# Altium project BK Robot.PrjPcb
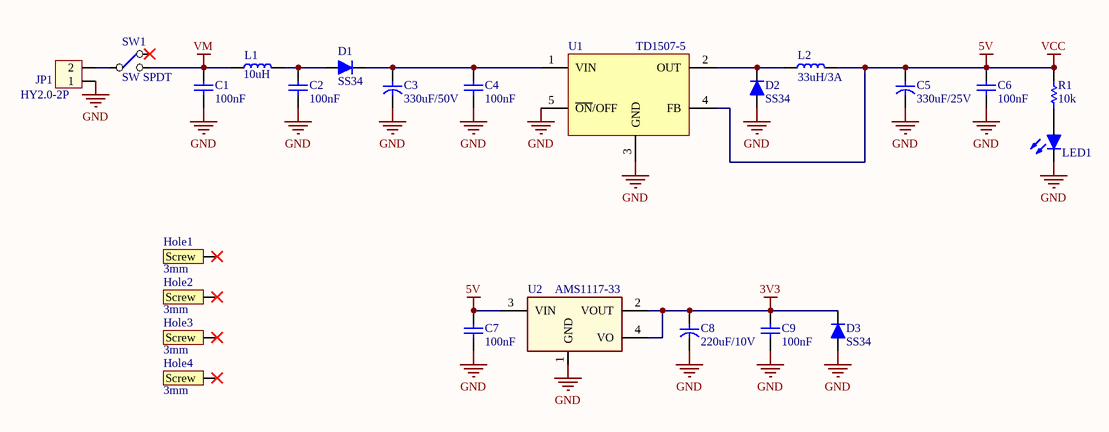
[diagram p0: Power.SchDoc]
5 sheets, 189 parts. Net scope: flat (ports and power ports of the same name join across sheets).
Board file: BK Robot.PcbDoc
Sheets:
  Power.SchDoc
  MCU.SchDoc
  MotorDriver.SchDoc
  Debug.SchDoc
  Peripheral.SchDoc

## Sheet Power.SchDoc
size A; SheetNumber: 1; SheetTotal: 5

### Parts
C1  100nF  [C 0603 (1608)]
C2  100nF  [C 0603 (1608)]
C3  330uF/50V  [C SMD ALU (G)]
C4  100nF  [C 0603 (1608)]
C5  330uF/25V  [C SMD ALU (F)]
C6  100nF  [C 0603 (1608)]
C7  100nF  [C 0603 (1608)]
C8  220uF/10V  [C SMD ALU (D)]
C9  100nF  [C 0603 (1608)]
D1  SS34  [DO-214AC (SMA)]
D2  SS34  [DO-214AC (SMA)]
D3  SS34  [DO-214AC (SMA)]
Hole1  3mm  [SCREW/3M/7M]
Hole2  3mm  [SCREW/3M/7M]
Hole3  3mm  [SCREW/3M/7M]
Hole4  3mm  [SCREW/3M/7M]
JP1  HY2.0-2P  [HY2.0-2P-RA]
L1  10uH  [Inductor SMD 0420]
L2  33uH/3A  [Inductor SMD 10x10x5]
LED1  Led-Red  [Led SMD 0603]  (value not drawn)
R1  10k  [R 0603 (1608)]
SW1  SW SPDT  [SW/3/SPDT/SS12D11]
U1  TD1507-5  [TO-252-5]
U2  AMS1117-33  [SOT-223]

### Nets
3V3: C8.1 C9.1 D3.2(K) U2.2(VOUT) U2.4(VO)
5V: C5.1 C6.1 C7.1 L2.2 R1.2 U1.4(FB) U2.3(VIN)  [also labelled VCC]
GND: C1.2 C2.2 C3.2 C4.2 C5.2 C6.2 C7.2 C8.2 C9.2 D2.1(A) D3.1(A) JP1.1 LED1.2(K) U1.3(GND) U1.5(~{ON}/OFF) U1.6(GND) U2.1(GND)
VM: C1.1 L1.1 SW1.3(NO1)
NetC2_1: C2.1 D1.1(A) L1.2
NetC3_1: C3.1 C4.1 D1.2(K) U1.1(VIN)
NetD2_2: D2.2(K) L2.1 U1.2(OUT)
NetJP1_2: JP1.2 SW1.2(COMMON1)
NetLED1_1: LED1.1(A) R1.1

Not connected (* = marked no-connect by the designer): Hole1 1(Screw)*; Hole2 1(Screw)*; Hole3 1(Screw)*; Hole4 1(Screw)*; SW1 1(NC1)*

### Library data of the parts
C1 C2 C4 C6 C7 C9 = Capacitor NP: Capacitor non-pol
C3 C5 C8 = Capacitor: Capacitor pol
D1-D3 = Diode: Default Diode; Published: 8-Jun-2000; LatestRevisionDate: 17-Jul-2002; LatestRevisionNote: Re-released for DXP Platform.; PackageVersion: Sep-1996; PackageReference: SMC; Publisher: Altium Limited; Code_JEDEC: DO-214-AB
Hole1-Hole4 = Screw
JP1 = Con2: Connector 2; Value: Connector 2
L1 L2 = Inductor
LED1 = Led: Typical LED
R1 = Resistor: Published: 8-Jun-2000; LatestRevisionDate: 17-Jul-2002; LatestRevisionNote: Re-released for DXP Platform.; PackageReference: AXIAL-0.3; Publisher: Altium Limited
U1 = TD1507: 4A 300KHz 32V Buck DC to DC Converter
U2 = AMS1117: 1A LDO Voltage Regulator, ADJ or fixed 1.5/1.8/2.5/2.85/3.3/5V

## Sheet MCU.SchDoc
size A3; SheetNumber: 2; SheetTotal: 5
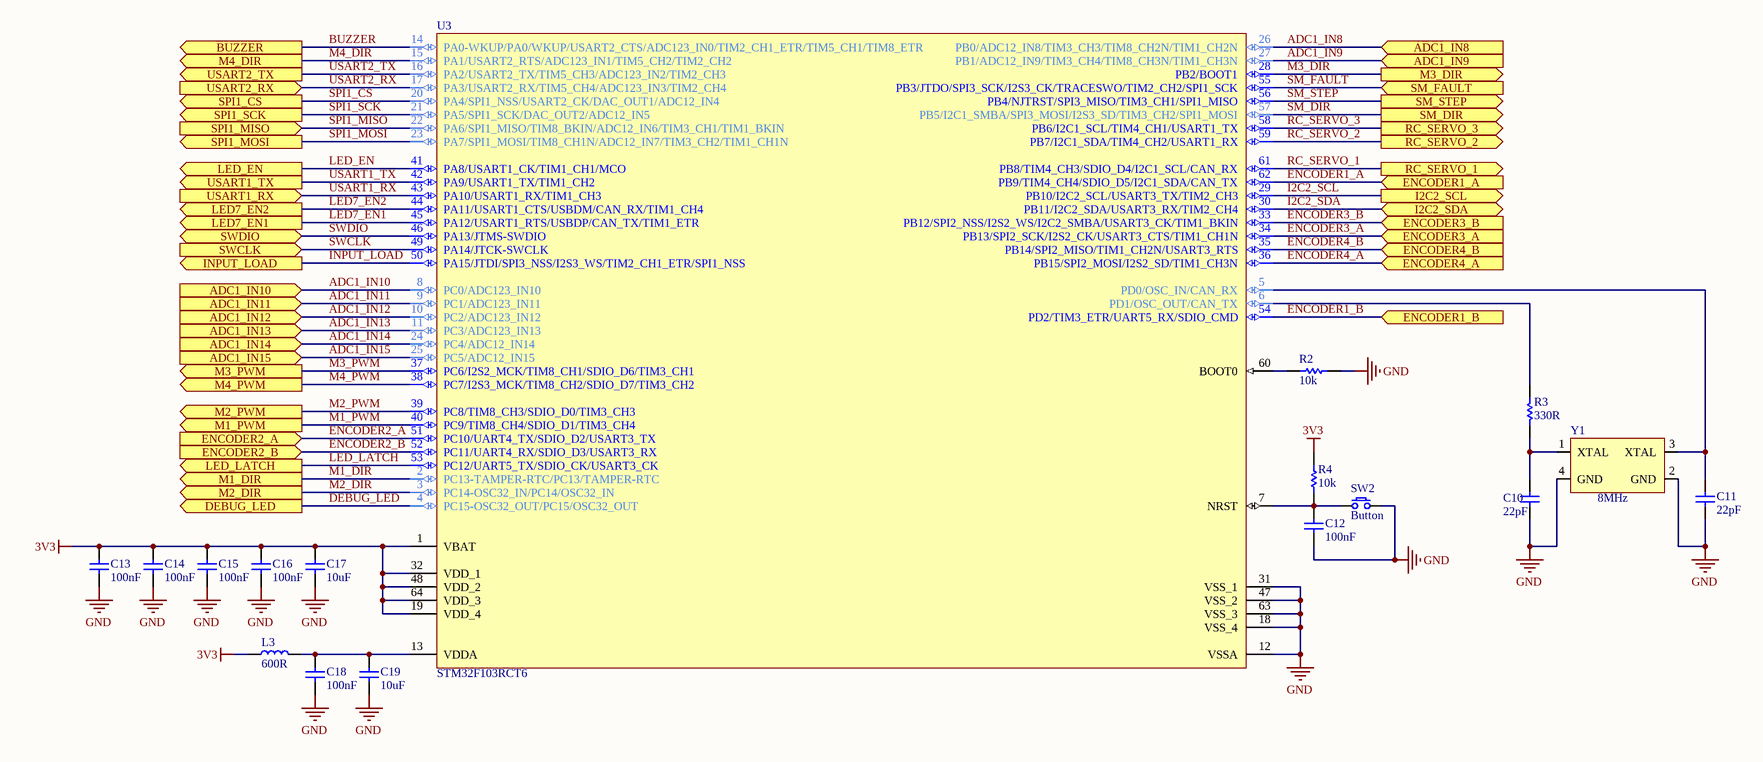
[diagram p1: MCU.SchDoc]

### Parts
C10  22pF  [C 0603 (1608)]
C11  22pF  [C 0603 (1608)]
C12  100nF  [C 0603 (1608)]
C13  100nF  [C 0603 (1608)]
C14  100nF  [C 0603 (1608)]
C15  100nF  [C 0603 (1608)]
C16  100nF  [C 0603 (1608)]
C17  10uF  [C 0603 (1608)]
C18  100nF  [C 0603 (1608)]
C19  10uF  [C 0603 (1608)]
L3  600R  [L 0603 (1608)]
R2  10k  [R 0603 (1608)]
R3  330R  [R 0603 (1608)]
R4  10k  [R 0603 (1608)]
SW2  Button  [SW/2/SMD - 6X6X5]
U3  STM32F103RCT6  [LQFP64_N]
Y1  8MHz  [Crystal SMD 4PIN 3225]

### Ports
ADC1_IN8 (in), ADC1_IN9 (in), ADC1_IN10 (in), ADC1_IN11 (in), ADC1_IN12 (in), ADC1_IN13 (in), ADC1_IN14 (in), ADC1_IN15 (in), BUZZER (out), DEBUG_LED (out), ENCODER1_A (in), ENCODER1_B (in), ENCODER2_A (in), ENCODER2_B (in), ENCODER3_A (in), ENCODER3_B (in), ENCODER4_A (in), ENCODER4_B (in), I2C2_SCL (out), I2C2_SDA (bidir), INPUT_LOAD (out), LED7_EN1 (out), LED7_EN2 (out), LED_EN (out), LED_LATCH (out), M1_DIR (out), M1_PWM (out), M2_DIR (out), M2_PWM (out), M3_DIR (out), M3_PWM (out), M4_DIR (out), M4_PWM (out), RC_SERVO_1 (out), RC_SERVO_2 (out), RC_SERVO_3 (out), SM_DIR (out), SM_FAULT (in), SM_STEP (out), SPI1_CS (out), SPI1_MISO (in), SPI1_MOSI (out), SPI1_SCK (out), SWCLK (in), SWDIO (bidir), USART1_RX (in), USART1_TX (out), USART2_RX (in), USART2_TX (out)

### Nets
3V3: C13.1 C14.1 C15.1 C16.1 C17.1 L3.2 R4.1 U3.1(VBAT) U3.19(VDD_4) U3.32(VDD_1) U3.48(VDD_2) U3.64(VDD_3)
GND: C10.2 C11.2 C12.2 C13.2 C14.2 C15.2 C16.2 C17.2 C18.2 C19.2 R2.1 SW2.2 U3.12(VSSA) U3.18(VSS_4) U3.31(VSS_1) U3.47(VSS_2) U3.63(VSS_3) Y1.2(GND) Y1.4(GND)
ADC1_IN8: U3.26(PB0/ADC12_IN8/TIM3_CH3/TIM8_CH2N/TIM1_CH2N) ; port ADC1_IN8
ADC1_IN9: U3.27(PB1/ADC12_IN9/TIM3_CH4/TIM8_CH3N/TIM1_CH3N) ; port ADC1_IN9
ADC1_IN10: U3.8(PC0/ADC123_IN10) ; port ADC1_IN10
ADC1_IN11: U3.9(PC1/ADC123_IN11) ; port ADC1_IN11
ADC1_IN12: U3.10(PC2/ADC123_IN12) ; port ADC1_IN12
ADC1_IN13: U3.11(PC3/ADC123_IN13) ; port ADC1_IN13
ADC1_IN14: U3.24(PC4/ADC12_IN14) ; port ADC1_IN14
ADC1_IN15: U3.25(PC5/ADC12_IN15) ; port ADC1_IN15
BUZZER: U3.14(PA0-WKUP/PA0/WKUP/USART2_CTS/ADC123_IN0/TIM2_CH1_ETR/TIM5_CH1/TIM8_ETR) ; port BUZZER
DEBUG_LED: U3.4(PC15-OSC32_OUT/PC15/OSC32_OUT) ; port DEBUG_LED
ENCODER1_A: U3.62(PB9/TIM4_CH4/SDIO_D5/I2C1_SDA/CAN_TX) ; port ENCODER1_A
ENCODER1_B: U3.54(PD2/TIM3_ETR/UART5_RX/SDIO_CMD) ; port ENCODER1_B
ENCODER2_A: U3.51(PC10/UART4_TX/SDIO_D2/USART3_TX) ; port ENCODER2_A
ENCODER2_B: U3.52(PC11/UART4_RX/SDIO_D3/USART3_RX) ; port ENCODER2_B
ENCODER3_A: U3.34(PB13/SPI2_SCK/I2S2_CK/USART3_CTS/TIM1_CH1N) ; port ENCODER3_A
ENCODER3_B: U3.33(PB12/SPI2_NSS/I2S2_WS/I2C2_SMBA/USART3_CK/TIM1_BKIN) ; port ENCODER3_B
ENCODER4_A: U3.36(PB15/SPI2_MOSI/I2S2_SD/TIM1_CH3N) ; port ENCODER4_A
ENCODER4_B: U3.35(PB14/SPI2_MISO/TIM1_CH2N/USART3_RTS) ; port ENCODER4_B
I2C2_SCL: U3.29(PB10/I2C2_SCL/USART3_TX/TIM2_CH3) ; port I2C2_SCL
I2C2_SDA: U3.30(PB11/I2C2_SDA/USART3_RX/TIM2_CH4) ; port I2C2_SDA
INPUT_LOAD: U3.50(PA15/JTDI/SPI3_NSS/I2S3_WS/TIM2_CH1_ETR/SPI1_NSS) ; port INPUT_LOAD
LED7_EN1: U3.45(PA12/USART1_RTS/USBDP/CAN_TX/TIM1_ETR) ; port LED7_EN1
LED7_EN2: U3.44(PA11/USART1_CTS/USBDM/CAN_RX/TIM1_CH4) ; port LED7_EN2
LED_EN: U3.41(PA8/USART1_CK/TIM1_CH1/MCO) ; port LED_EN
LED_LATCH: U3.53(PC12/UART5_TX/SDIO_CK/USART3_CK) ; port LED_LATCH
M1_DIR: U3.2(PC13-TAMPER-RTC/PC13/TAMPER-RTC) ; port M1_DIR
M1_PWM: U3.40(PC9/TIM8_CH4/SDIO_D1/TIM3_CH4) ; port M1_PWM
M2_DIR: U3.3(PC14-OSC32_IN/PC14/OSC32_IN) ; port M2_DIR
M2_PWM: U3.39(PC8/TIM8_CH3/SDIO_D0/TIM3_CH3) ; port M2_PWM
M3_DIR: U3.28(PB2/BOOT1) ; port M3_DIR
M3_PWM: U3.37(PC6/I2S2_MCK/TIM8_CH1/SDIO_D6/TIM3_CH1) ; port M3_PWM
M4_DIR: U3.15(PA1/USART2_RTS/ADC123_IN1/TIM5_CH2/TIM2_CH2) ; port M4_DIR
M4_PWM: U3.38(PC7/I2S3_MCK/TIM8_CH2/SDIO_D7/TIM3_CH2) ; port M4_PWM
RC_SERVO_1: U3.61(PB8/TIM4_CH3/SDIO_D4/I2C1_SCL/CAN_RX) ; port RC_SERVO_1
RC_SERVO_2: U3.59(PB7/I2C1_SDA/TIM4_CH2/USART1_RX) ; port RC_SERVO_2
RC_SERVO_3: U3.58(PB6/I2C1_SCL/TIM4_CH1/USART1_TX) ; port RC_SERVO_3
SM_DIR: U3.57(PB5/I2C1_SMBA/SPI3_MOSI/I2S3_SD/TIM3_CH2/SPI1_MOSI) ; port SM_DIR
SM_FAULT: U3.55(PB3/JTDO/SPI3_SCK/I2S3_CK/TRACESWO/TIM2_CH2/SPI1_SCK) ; port SM_FAULT
SM_STEP: U3.56(PB4/NJTRST/SPI3_MISO/TIM3_CH1/SPI1_MISO) ; port SM_STEP
SPI1_CS: U3.20(PA4/SPI1_NSS/USART2_CK/DAC_OUT1/ADC12_IN4) ; port SPI1_CS
SPI1_MISO: U3.22(PA6/SPI1_MISO/TIM8_BKIN/ADC12_IN6/TIM3_CH1/TIM1_BKIN) ; port SPI1_MISO
SPI1_MOSI: U3.23(PA7/SPI1_MOSI/TIM8_CH1N/ADC12_IN7/TIM3_CH2/TIM1_CH1N) ; port SPI1_MOSI
SPI1_SCK: U3.21(PA5/SPI1_SCK/DAC_OUT2/ADC12_IN5) ; port SPI1_SCK
SWCLK: U3.49(PA14/JTCK-SWCLK) ; port SWCLK
SWDIO: U3.46(PA13/JTMS-SWDIO) ; port SWDIO
USART1_RX: U3.43(PA10/USART1_RX/TIM1_CH3) ; port USART1_RX
USART1_TX: U3.42(PA9/USART1_TX/TIM1_CH2) ; port USART1_TX
USART2_RX: U3.17(PA3/USART2_RX/TIM5_CH4/ADC123_IN3/TIM2_CH4) ; port USART2_RX
USART2_TX: U3.16(PA2/USART2_TX/TIM5_CH3/ADC123_IN2/TIM2_CH3) ; port USART2_TX
NetC10_1: C10.1 R3.1 Y1.1(XTAL)
NetC11_1: C11.1 U3.5(PD0/OSC_IN/CAN_RX) Y1.3(XTAL)
NetC12_1: C12.1 R4.2 SW2.1 U3.7(NRST)
NetC18_1: C18.1 C19.1 L3.1 U3.13(VDDA)
NetR2_2: R2.2 U3.60(BOOT0)
NetR3_2: R3.2 U3.6(PD1/OSC_OUT/CAN_TX)

### Library data of the parts
C10-C19 = Capacitor NP: Capacitor non-pol
L3 = Inductor
R2-R4 = Resistor: Published: 8-Jun-2000; LatestRevisionDate: 17-Jul-2002; LatestRevisionNote: Re-released for DXP Platform.; PackageReference: AXIAL-0.3; Publisher: Altium Limited
SW2 = SW SPST: Tact switch 2 pin
U3 = STM32F103RCT6: ARM Cortex-M3 32-bit MCU, 256 KB Flash, 48 KB Internal RAM, 51 I/Os, 64-pin LQFP, -40 to 85 degC, Tray; A/D Converter: 3x12-bit (16 Channel); D/A Converter: 2x12-bit (2 Channel); FLASH Size (Prog) (kB): 256; I/Os (High Current): 51; Internal RAM Size (kB): 48; Operating Frequency(F) (Processor speed) (MHz): 72; Supply Voltage(Vcc) min (V): 2; DatasheetVersion: Rev. 8; PackageVersion: Rev. 4, 06/2013; PackageReference: LQFP64; PackageDescription: 64-Pin Low Profile Quad Flat Package, 10 x 10 mm Body, 0.5 mm Pitch; Supplier 1: Digi-Key; Supplier Part Number 1: 497-9033-ND; Supplier 2: Newark; Supplier Part Number 2: 01P4099; Supplier 3: Newark; Supplier Part Number 3: 57P1227; Supplier 4: Mouser; Supplier Part Number 4: 511-STM32F103RCT6; Core: ARM Cortex-M3; Packing: Tray; Mounting Technology: Surface Mount; PartNumber: STM32F103RCT6; ComponentLink1Description: Manufacturer URL; ComponentLink1URL: http://www.st.com/web/en/home.html; ComponentLink2Description: Datasheet; ComponentLink2URL: http://www.st.com/st-web-ui/static/active/en/resource/technical/document/datasheet/CD00191185.pdf; ComponentLink3Description: Package Specification; ComponentLink3URL: http://www.st.com/st-web-ui/static/active/en/resource/technical/document/datasheet/DM00037051.pdf
Y1 = Crystal 4pin

## Sheet MotorDriver.SchDoc
size A3; SheetNumber: 3; SheetTotal: 4
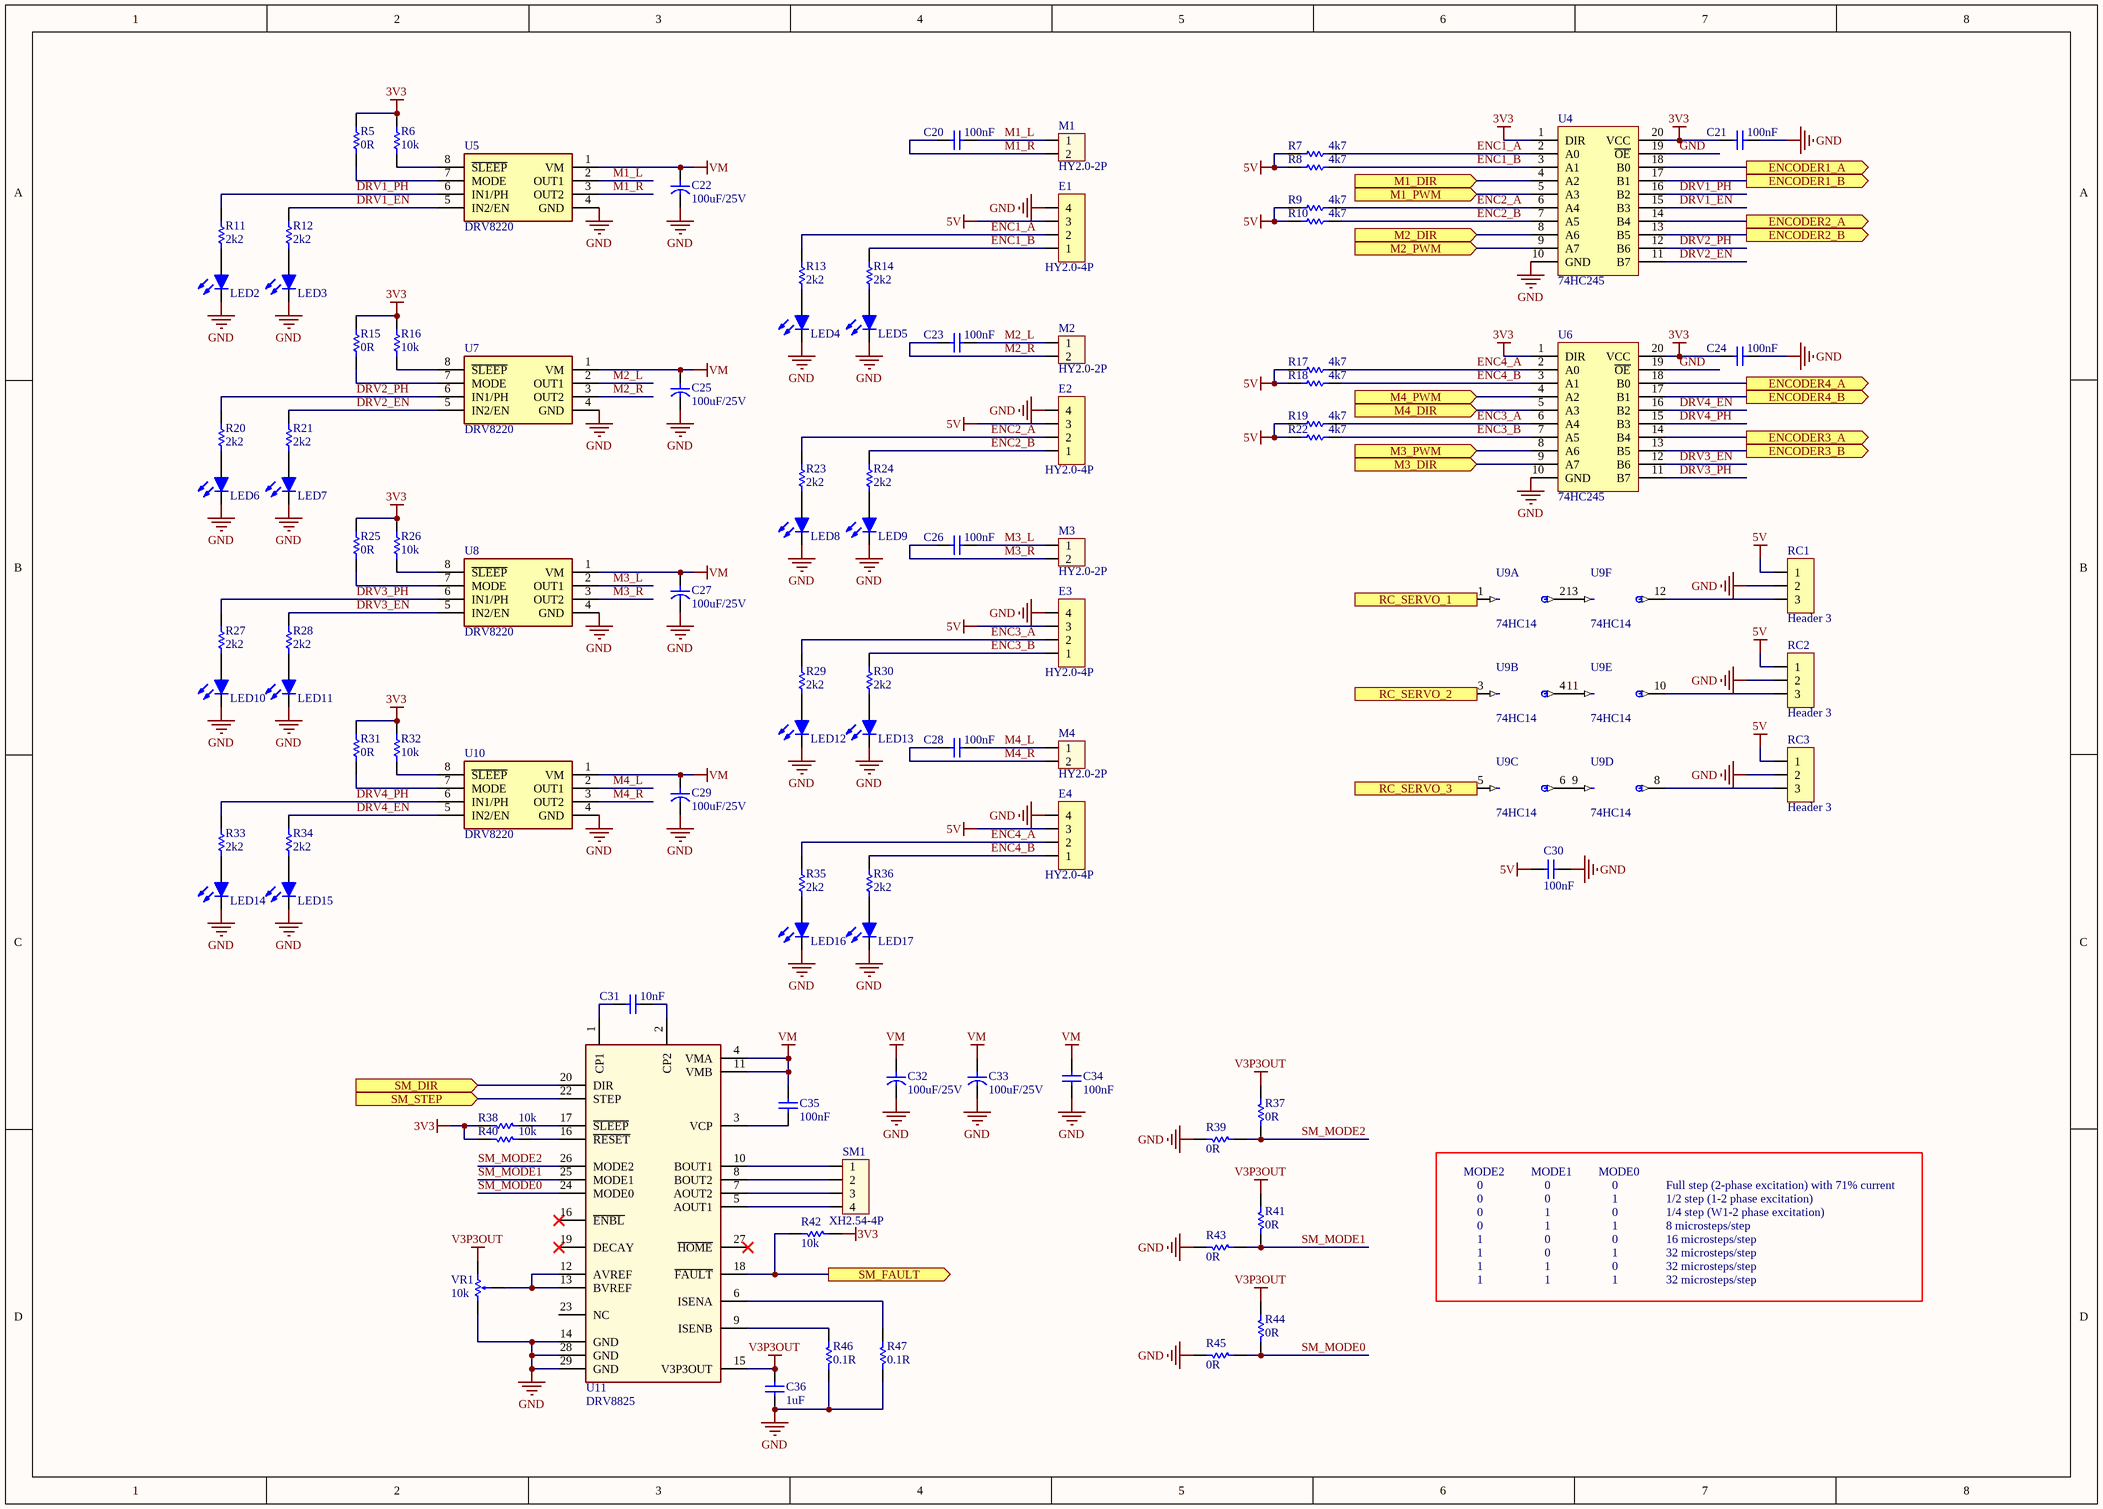
[diagram p2: MotorDriver.SchDoc]

### Parts
C20  100nF  [C 0603 (1608)]
C21  100nF  [C 0603 (1608)]
C22  100uF/25V  [C SMD ALU (D8)]
C23  100nF  [C 0603 (1608)]
C24  100nF  [C 0603 (1608)]
C25  100uF/25V  [C SMD ALU (D8)]
C26  100nF  [C 0603 (1608)]
C27  100uF/25V  [C SMD ALU (D8)]
C28  100nF  [C 0603 (1608)]
C29  100uF/25V  [C SMD ALU (D8)]
C30  100nF  [C 0603 (1608)]
C31  10nF  [C 0603 (1608)]
C32  100uF/25V  [C SMD ALU (D8)]
C33  100uF/25V  [C SMD ALU (D8)]
C34  100nF  [C 0603 (1608)]
C35  100nF  [C 0603 (1608)]
C36  1uF  [C 0603 (1608)]
E1  HY2.0-4P  [HY2.0-4P-RA]
E2  HY2.0-4P  [HY2.0-4P-RA]
E3  HY2.0-4P  [HY2.0-4P-RA]
E4  HY2.0-4P  [HY2.0-4P-RA]
LED2  Led-Red  [Led SMD 0603]  (value not drawn)
LED3  Led-Red  [Led SMD 0603]  (value not drawn)
LED4  Led-Red  [Led SMD 0603]  (value not drawn)
LED5  Led-Red  [Led SMD 0603]  (value not drawn)
LED6  Led-Red  [Led SMD 0603]  (value not drawn)
LED7  Led-Red  [Led SMD 0603]  (value not drawn)
LED8  Led-Red  [Led SMD 0603]  (value not drawn)
LED9  Led-Red  [Led SMD 0603]  (value not drawn)
LED10  Led-Red  [Led SMD 0603]  (value not drawn)
LED11  Led-Red  [Led SMD 0603]  (value not drawn)
LED12  Led-Red  [Led SMD 0603]  (value not drawn)
LED13  Led-Red  [Led SMD 0603]  (value not drawn)
LED14  Led-Red  [Led SMD 0603]  (value not drawn)
LED15  Led-Red  [Led SMD 0603]  (value not drawn)
LED16  Led-Red  [Led SMD 0603]  (value not drawn)
LED17  Led-Red  [Led SMD 0603]  (value not drawn)
M1  HY2.0-2P  [HY2.0-2P-RA]
M2  HY2.0-2P  [HY2.0-2P-RA]
M3  HY2.0-2P  [HY2.0-2P-RA]
M4  HY2.0-2P  [HY2.0-2P-RA]
R5  0R  [R 0603 (1608)]
R6  10k  [R 0603 (1608)]
R7  4k7  [R 0603 (1608)]
R8  4k7  [R 0603 (1608)]
R9  4k7  [R 0603 (1608)]
R10  4k7  [R 0603 (1608)]
R11  2k2  [R 0603 (1608)]
R12  2k2  [R 0603 (1608)]
R13  2k2  [R 0603 (1608)]
R14  2k2  [R 0603 (1608)]
R15  0R  [R 0603 (1608)]
R16  10k  [R 0603 (1608)]
R17  4k7  [R 0603 (1608)]
R18  4k7  [R 0603 (1608)]
R19  4k7  [R 0603 (1608)]
R20  2k2  [R 0603 (1608)]
R21  2k2  [R 0603 (1608)]
R22  4k7  [R 0603 (1608)]
R23  2k2  [R 0603 (1608)]
R24  2k2  [R 0603 (1608)]
R25  0R  [R 0603 (1608)]
R26  10k  [R 0603 (1608)]
R27  2k2  [R 0603 (1608)]
R28  2k2  [R 0603 (1608)]
R29  2k2  [R 0603 (1608)]
R30  2k2  [R 0603 (1608)]
R31  0R  [R 0603 (1608)]
R32  10k  [R 0603 (1608)]
R33  2k2  [R 0603 (1608)]
R34  2k2  [R 0603 (1608)]
R35  2k2  [R 0603 (1608)]
R36  2k2  [R 0603 (1608)]
R37  0R  [R 0603 (1608)]
R38  10k  [R 0603 (1608)]
R39  0R  [R 0603 (1608)]
R40  10k  [R 0603 (1608)]
R41  0R  [R 0603 (1608)]
R42  10k  [R 0603 (1608)]
R43  0R  [R 0603 (1608)]
R44  0R  [R 0603 (1608)]
R45  0R  [R 0603 (1608)]
R46  0.1R  [R 1206 (3216)]
R47  0.1R  [R 1206 (3216)]
RC1  Header 3  [Header 3 - RA]
RC2  Header 3  [Header 3 - RA]
RC3  Header 3  [Header 3 - RA]
SM1  XH2.54-4P  [CON Header 4 - RA]
U4  74HC245  [TSSOP 20 65P]
U5  DRV8220  [WSON 2X2X0.5MM]
U6  74HC245  [TSSOP 20 65P]
U7  DRV8220  [WSON 2X2X0.5MM]
U8  DRV8220  [WSON 2X2X0.5MM]
U9  74HC14  [TSSOP 14 65P]  (parts A,B,C,D,E,F of 6)
U10  DRV8220  [WSON 2X2X0.5MM]
U11  DRV8825  [TSSOP 28 65P EP]
VR1  10k  [TRIM_TC33X-2-103E]

### Ports
ENCODER1_A (out), ENCODER1_B (out), ENCODER2_A (out), ENCODER2_B (out), ENCODER3_A (out), ENCODER3_B (out), ENCODER4_A (out), ENCODER4_B (out), M1_DIR (in), M1_PWM (in), M2_DIR (in), M2_PWM (in), M3_DIR (in), M3_PWM (in), M4_DIR (in), M4_PWM (in), RC_SERVO_1 (in), RC_SERVO_2 (in), RC_SERVO_3 (in), SM_DIR (in), SM_FAULT (out), SM_STEP (in)

### Nets
3V3: C21.1 C24.1 R5.2 R6.2 R15.2 R16.2 R25.2 R26.2 R31.2 R32.2 R38.1 R40.1 R42.2 U4.1(DIR) U4.20(VCC) U6.1(DIR) U6.20(VCC)
5V: C30.1 E1.3 E2.3 E3.3 E4.3 R7.2 R8.2 R9.2 R10.2 R17.2 R18.2 R19.2 R22.2 RC1.1 RC2.1 RC3.1 U9.14(+)  [also labelled VCC]
GND: C21.2 C22.2 C24.2 C25.2 C27.2 C29.2 C30.2 C32.2 C33.2 C34.1 C36.2 E1.4 E2.4 E3.4 E4.4 LED2.2(K) LED3.2(K) LED4.2(K) LED5.2(K) LED6.2(K) LED7.2(K) LED8.2(K) LED9.2(K) LED10.2(K) LED11.2(K) LED12.2(K) LED13.2(K) LED14.2(K) LED15.2(K) LED16.2(K) LED17.2(K) R39.1 R43.1 R45.1 R46.2 R47.2 RC1.2 RC2.2 RC3.2 U4.10(GND) U4.19(~{OE}) U5.4(GND) U6.10(GND) U6.19(~{OE}) U7.4(GND) U8.4(GND) U9.7(GND) U10.4(GND) U11.14(GND) U11.28(GND) U11.29(GND) VR1.3
V3P3OUT: C36.1 R37.1 R41.1 R44.1 U11.15(V3P3OUT) VR1.1
VM: C22.1 C25.1 C27.1 C29.1 C32.1 C33.1 C34.2 C35.1 U5.1(VM) U7.1(VM) U8.1(VM) U10.1(VM) U11.4(VMA) U11.11(VMB)
DRV1_EN: R12.2 U4.15(B3) U5.5(IN2/EN)
DRV1_PH: R11.2 U4.16(B2) U5.6(IN1/PH)
DRV2_EN: R21.2 U4.11(B7) U7.5(IN2/EN)
DRV2_PH: R20.2 U4.12(B6) U7.6(IN1/PH)
DRV3_EN: R28.2 U6.12(B6) U8.5(IN2/EN)
DRV3_PH: R27.2 U6.11(B7) U8.6(IN1/PH)
DRV4_EN: R34.2 U6.16(B2) U10.5(IN2/EN)
DRV4_PH: R33.2 U6.15(B3) U10.6(IN1/PH)
ENC1_A: E1.2 R7.1 R13.2 U4.2(A0)
ENC1_B: E1.1 R8.1 R14.2 U4.3(A1)
ENC2_A: E2.2 R9.1 R23.2 U4.6(A4)
ENC2_B: E2.1 R10.1 R24.2 U4.7(A5)
ENC3_A: E3.2 R19.1 R29.2 U6.6(A4)
ENC3_B: E3.1 R22.1 R30.2 U6.7(A5)
ENC4_A: E4.2 R17.1 R35.2 U6.2(A0)
ENC4_B: E4.1 R18.1 R36.2 U6.3(A1)
ENCODER1_A: U4.18(B0) ; port ENCODER1_A
ENCODER1_B: U4.17(B1) ; port ENCODER1_B
ENCODER2_A: U4.14(B4) ; port ENCODER2_A
ENCODER2_B: U4.13(B5) ; port ENCODER2_B
ENCODER3_A: U6.14(B4) ; port ENCODER3_A
ENCODER3_B: U6.13(B5) ; port ENCODER3_B
ENCODER4_A: U6.18(B0) ; port ENCODER4_A
ENCODER4_B: U6.17(B1) ; port ENCODER4_B
M1_DIR: U4.4(A2) ; port M1_DIR
M1_L: C20.2 M1.1 U5.2(OUT1)
M1_PWM: U4.5(A3) ; port M1_PWM
M1_R: C20.1 M1.2 U5.3(OUT2)
M2_DIR: U4.8(A6) ; port M2_DIR
M2_L: C23.2 M2.1 U7.2(OUT1)
M2_PWM: U4.9(A7) ; port M2_PWM
M2_R: C23.1 M2.2 U7.3(OUT2)
M3_DIR: U6.9(A7) ; port M3_DIR
M3_L: C26.2 M3.1 U8.2(OUT1)
M3_PWM: U6.8(A6) ; port M3_PWM
M3_R: C26.1 M3.2 U8.3(OUT2)
M4_DIR: U6.5(A3) ; port M4_DIR
M4_L: C28.2 M4.1 U10.2(OUT1)
M4_PWM: U6.4(A2) ; port M4_PWM
M4_R: C28.1 M4.2 U10.3(OUT2)
RC_SERVO_1: U9.1(1A) ; port RC_SERVO_1
RC_SERVO_2: U9.3(2A) ; port RC_SERVO_2
RC_SERVO_3: U9.5(3A) ; port RC_SERVO_3
SM_DIR: U11.20(DIR) ; port SM_DIR
SM_FAULT: R42.1 U11.18(~{FAULT}) ; port SM_FAULT
SM_MODE0: R44.2 R45.2 U11.24(MODE0)
SM_MODE1: R41.2 R43.2 U11.25(MODE1)
SM_MODE2: R37.2 R39.2 U11.26(MODE2)
SM_STEP: U11.22(STEP) ; port SM_STEP
NetC31_1: C31.1 U11.2(CP2)
NetC31_2: C31.2 U11.1(CP1)
NetC35_2: C35.2 U11.3(VCP)
NetLED2_1: LED2.1(A) R11.1
NetLED3_1: LED3.1(A) R12.1
NetLED4_1: LED4.1(A) R13.1
NetLED5_1: LED5.1(A) R14.1
NetLED6_1: LED6.1(A) R20.1
NetLED7_1: LED7.1(A) R21.1
NetLED8_1: LED8.1(A) R23.1
NetLED9_1: LED9.1(A) R24.1
NetLED10_1: LED10.1(A) R27.1
NetLED11_1: LED11.1(A) R28.1
NetLED12_1: LED12.1(A) R29.1
NetLED13_1: LED13.1(A) R30.1
NetLED14_1: LED14.1(A) R33.1
NetLED15_1: LED15.1(A) R34.1
NetLED16_1: LED16.1(A) R35.1
NetLED17_1: LED17.1(A) R36.1
NetR5_1: R5.1 U5.7(MODE)
NetR6_1: R6.1 U5.8(~{SLEEP})
NetR15_1: R15.1 U7.7(MODE)
NetR16_1: R16.1 U7.8(~{SLEEP})
NetR25_1: R25.1 U8.7(MODE)
NetR26_1: R26.1 U8.8(~{SLEEP})
NetR31_1: R31.1 U10.7(MODE)
NetR32_1: R32.1 U10.8(~{SLEEP})
NetR38_2: R38.2 U11.17(~{SLEEP})
NetR40_2: R40.2 U11.16(~{RESET})
NetR46_1: R46.1 U11.9(ISENB)
NetR47_1: R47.1 U11.6(ISENA)
NetRC1_3: RC1.3 U9.12(6Y)
NetRC2_3: RC2.3 U9.10(5Y)
NetRC3_3: RC3.3 U9.8(4Y)
NetSM1_1: SM1.1 U11.10(BOUT1)
NetSM1_2: SM1.2 U11.8(BOUT2)
NetSM1_3: SM1.3 U11.7(AOUT2)
NetSM1_4: SM1.4 U11.5(AOUT1)
NetU9_2: U9.2(1Y) U9.13(6A)
NetU9_4: U9.4(2Y) U9.11(5A)
NetU9_6: U9.6(3Y) U9.9(4A)
NetU11_12: U11.12(AVREF) U11.13(BVREF) VR1.2

Not connected (* = marked no-connect by the designer): U11 19(DECAY)* 23(NC) 27(~{HOME})*

### Notes on the sheet
- MODE2
- 0
- MODE1
- MODE0
- Full step (2-phase excitation) with 71% current
- 1
- 1/2 step (1-2 phase excitation)
- 1/4 step (W1-2 phase excitation)
- 8 microsteps/step
- 16 microsteps/step
- 32 microsteps/step

### Library data of the parts
C20 C21 C23 C24 C26 C28 C30 C31 C34-C36 = Capacitor NP: Capacitor non-pol
C22 C25 C27 C29 C32 C33 = Capacitor: Capacitor pol
E1-E4 = Header 4: Header, 4-Pin
LED2-LED17 = Led: Typical LED
M1-M4 = Con2: Connector 2; Value: Connector 2
R5-R47 = Resistor: Published: 8-Jun-2000; LatestRevisionDate: 17-Jul-2002; LatestRevisionNote: Re-released for DXP Platform.; PackageReference: AXIAL-0.3; Publisher: Altium Limited
RC1-RC3 = Header 3: Header, 3-Pin
SM1 = Con4: Connector 4; Value: Connector 4
U4 U6 = 74HC245: Octal bus tranceiver, 3-state
U5 U7 U8 U10 = DRV8220: 18-V H-Bridge Motor Driver; MP: DRV8838DSGR; MF: Texas Instruments; Package: WSON-8 Texas Instruments; SnapEDA_Link: https://www.snapeda.com/parts/DRV8838DSGR/Texas+Instruments/view-part/?ref=snap; Purchase-URL: https://pricing.snapeda.com/search/part/DRV8838DSGR/?ref=eda; Check_prices: https://www.snapeda.com/parts/DRV8838DSGR/Texas+Instruments/view-part/?ref=eda; Availability: In Stock; Value: *; Price: None
U9 = 74HC14: Hex Schmitt Trigger
VR1 = Resistor Variable

## Sheet Debug.SchDoc
size A; SheetNumber: 4; SheetTotal: 5
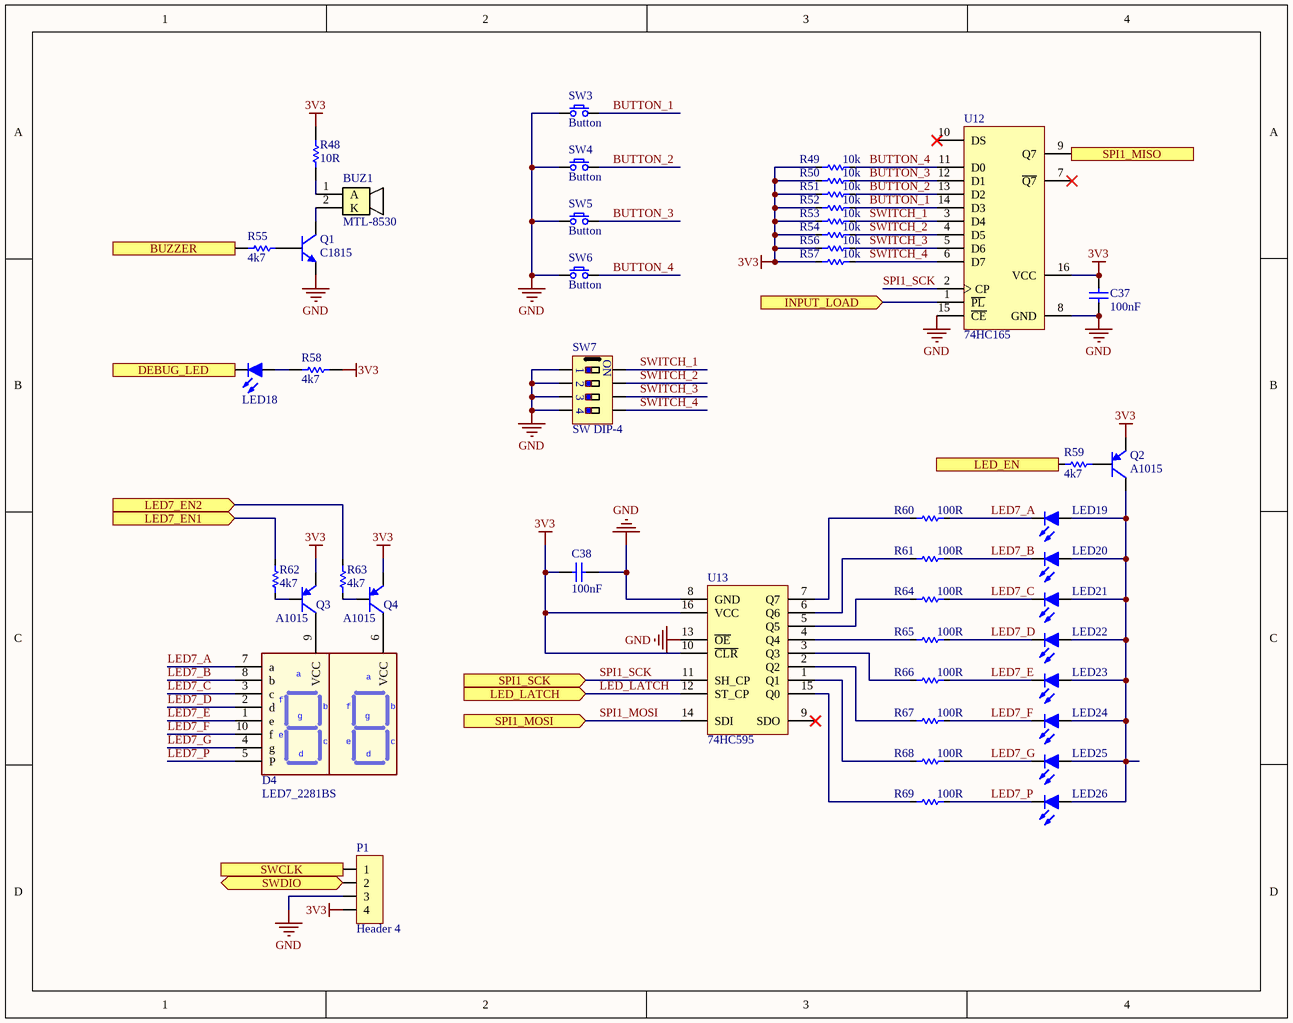
[diagram p3: Debug.SchDoc]

### Parts
BUZ1  MTL-8530  [MLT-8530]
C37  100nF  [C 0603 (1608)]
C38  100nF  [C 0603 (1608)]
D4  LED7_2281BS  [LED7 2281]
LED18  Led-Red  [Led SMD 0603 RED]  (value not drawn)
LED19  Led-Red  [Led SMD 0603 RED]  (value not drawn)
LED20  Led-Red  [Led SMD 0603 RED]  (value not drawn)
LED21  Led-Red  [Led SMD 0603 RED]  (value not drawn)
LED22  Led-Red  [Led SMD 0603 RED]  (value not drawn)
LED23  Led-Red  [Led SMD 0603 RED]  (value not drawn)
LED24  Led-Red  [Led SMD 0603 RED]  (value not drawn)
LED25  Led-Red  [Led SMD 0603 RED]  (value not drawn)
LED26  Led-Red  [Led SMD 0603 RED]  (value not drawn)
P1  Header 4  [Header 4]
Q1  C1815  [SOT-23]
Q2  A1015  [SOT-23]
Q3  A1015  [SOT-23]
Q4  A1015  [SOT-23]
R48  10R  [R 0603 (1608)]
R49  10k  [R 0603 (1608)]
R50  10k  [R 0603 (1608)]
R51  10k  [R 0603 (1608)]
R52  10k  [R 0603 (1608)]
R53  10k  [R 0603 (1608)]
R54  10k  [R 0603 (1608)]
R55  4k7  [R 0603 (1608)]
R56  10k  [R 0603 (1608)]
R57  10k  [R 0603 (1608)]
R58  4k7  [R 0603 (1608)]
R59  4k7  [R 0603 (1608)]
R60  100R  [R 0603 (1608)]
R61  100R  [R 0603 (1608)]
R62  4k7  [R 0603 (1608)]
R63  4k7  [R 0603 (1608)]
R64  100R  [R 0603 (1608)]
R65  100R  [R 0603 (1608)]
R66  100R  [R 0603 (1608)]
R67  100R  [R 0603 (1608)]
R68  100R  [R 0603 (1608)]
R69  100R  [R 0603 (1608)]
SW3  Button  [SW/2/SMD - 6X6X5]
SW4  Button  [SW/2/SMD - 6X6X5]
SW5  Button  [SW/2/SMD - 6X6X5]
SW6  Button  [SW/2/SMD - 6X6X5]
SW7  SW DIP-4  [SW/DIP4]
U12  74HC165  [TSSOP 16 65P]
U13  74HC595  [TSSOP 16 65P]

### Ports
BUZZER (in), DEBUG_LED (in), INPUT_LOAD (in), LED7_EN1 (in), LED7_EN2 (in), LED_EN (in), LED_LATCH (in), SPI1_MISO (out), SPI1_MOSI (in), SPI1_SCK (in), SWCLK (out), SWDIO (bidir)

### Nets
3V3: C37.1 C38.1 P1.4 Q2.2(E) Q3.2(E) Q4.2(E) R48.2 R49.1 R50.1 R51.1 R52.1 R53.1 R54.1 R56.1 R57.1 R58.2 U12.16(VCC) U13.10(~{CLR}) U13.16(VCC)
GND: C37.2 C38.2 P1.3 Q1.2(E) SW3.1 SW4.1 SW5.1 SW6.1 SW7.1 SW7.2 SW7.3 SW7.4 U12.8(GND) U12.15(~{CE}) U13.8(GND) U13.13(~{OE})
BUTTON_1: R52.2 SW3.2 U12.14(D3)
BUTTON_2: R51.2 SW4.2 U12.13(D2)
BUTTON_3: R50.2 SW5.2 U12.12(D1)
BUTTON_4: R49.2 SW6.2 U12.11(D0)
BUZZER: R55.1 ; port BUZZER
DEBUG_LED: LED18.2(K) ; port DEBUG_LED
INPUT_LOAD: U12.1(~{PL}) ; port INPUT_LOAD
LED7_A: D4.7(a) LED19.2(K) R60.2
LED7_B: D4.8(b) LED20.2(K) R61.2
LED7_C: D4.3(c) LED21.2(K) R64.2
LED7_D: D4.2(d) LED22.2(K) R65.2
LED7_E: D4.1(e) LED23.2(K) R66.2
LED7_EN1: R62.2 ; port LED7_EN1
LED7_EN2: R63.2 ; port LED7_EN2
LED7_F: D4.10(f) LED24.2(K) R67.2
LED7_G: D4.4(g) LED25.2(K) R68.2
LED7_P: D4.5(P) LED26.2(K) R69.2
LED_EN: R59.2 ; port LED_EN
LED_LATCH: U13.12(ST_CP) ; port LED_LATCH
SPI1_MISO: U12.9(Q7) ; port SPI1_MISO
SPI1_MOSI: U13.14(SDI) ; port SPI1_MOSI
SPI1_SCK: U12.2(CP) U13.11(SH_CP) ; port SPI1_SCK
SWCLK: P1.1 ; port SWCLK
SWDIO: P1.2 ; port SWDIO
SWITCH_1: R53.2 SW7.8 U12.3(D4)
SWITCH_2: R54.2 SW7.7 U12.4(D5)
SWITCH_3: R56.2 SW7.6 U12.5(D6)
SWITCH_4: R57.2 SW7.5 U12.6(D7)
NetBUZ1_1: BUZ1.1(A) R48.1
NetBUZ1_2: BUZ1.2(K) Q1.3(C)
NetD4_6: D4.6(VCC) Q4.3(C)
NetD4_9: D4.9(VCC) Q3.3(C)
NetLED18_1: LED18.1(A) R58.1
NetLED19_1: LED19.1(A) LED20.1(A) LED21.1(A) LED22.1(A) LED23.1(A) LED24.1(A) LED25.1(A) LED26.1(A) Q2.3(C)
NetQ1_1: Q1.1(B) R55.2
NetQ2_1: Q2.1(B) R59.1
NetQ3_1: Q3.1(B) R62.1
NetQ4_1: Q4.1(B) R63.1
NetR60_1: R60.1 U13.7(Q7)
NetR61_1: R61.1 U13.6(Q6)
NetR64_1: R64.1 U13.5(Q5)
NetR65_1: R65.1 U13.4(Q4)
NetR66_1: R66.1 U13.3(Q3)
NetR67_1: R67.1 U13.2(Q2)
NetR68_1: R68.1 U13.1(Q1)
NetR69_1: R69.1 U13.15(Q0)

Not connected (* = marked no-connect by the designer): U12 7(~{Q7})* 10(DS)*; U13 9(SDO)*

### Notes on the sheet
- (in symbol SW DIP-4) ON

### Library data of the parts
BUZ1 = Buzzer
C37 C38 = Capacitor NP: Capacitor non-pol
LED18-LED26 = Led: Typical LED
P1 = Header 4: Header, 4-Pin
Q1 = Transistor NPN: NPN Bipolar Transistor
Q2-Q4 = Transistor PNP: PNP Bipolar Transistor; Published: 8-Jun-2000; LatestRevisionDate: 29-May-2009; LatestRevisionNote: IPC-7351 Footprint Added.; PackageVersion: Aug-1999; PackageReference: SOT-23B; Publisher: Altium Limited; PackageDescription: 3-Pin SOT-23 Package 0.95 mm Pitch, 2.4 mm Lead Span
R48-R69 = Resistor: Published: 8-Jun-2000; LatestRevisionDate: 17-Jul-2002; LatestRevisionNote: Re-released for DXP Platform.; PackageReference: AXIAL-0.3; Publisher: Altium Limited
SW3-SW6 = SW SPST: Tact switch 2 pin
U12 = 74HC165: 8-bit serial-in, serial or parallel-out  shift register with output latches;  3-state
U13 = 74HC595: 8-bit serial-in, serial or parallel-out  shift register with output latches;  3-state

## Sheet Peripheral.SchDoc
size A; SheetNumber: 5; SheetTotal: 5
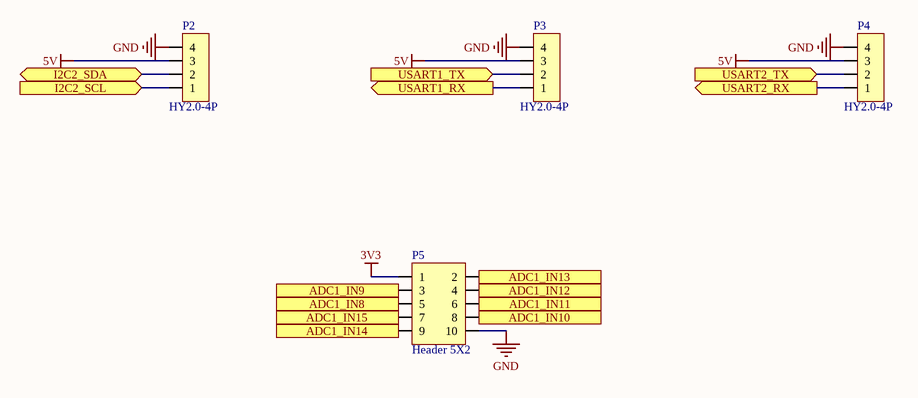
[diagram p4: Peripheral.SchDoc]

### Parts
P2  HY2.0-4P  [HY2.0-4P-RA]
P3  HY2.0-4P  [HY2.0-4P-RA]
P4  HY2.0-4P  [HY2.0-4P-RA]
P5  Header 5X2  [DC3-10P-1.27MM-RA]

### Ports
ADC1_IN8 (out), ADC1_IN9 (out), ADC1_IN10 (out), ADC1_IN11 (out), ADC1_IN12 (out), ADC1_IN13 (out), ADC1_IN14 (out), ADC1_IN15 (out), I2C2_SCL (in), I2C2_SDA (bidir), USART1_RX (out), USART1_TX (in), USART2_RX (out), USART2_TX (in)

### Nets
3V3: P5.1
5V: P2.3 P3.3 P4.3
GND: P2.4 P3.4 P4.4 P5.10
ADC1_IN8: P5.5 ; port ADC1_IN8
ADC1_IN9: P5.3 ; port ADC1_IN9
ADC1_IN10: P5.8 ; port ADC1_IN10
ADC1_IN11: P5.6 ; port ADC1_IN11
ADC1_IN12: P5.4 ; port ADC1_IN12
ADC1_IN13: P5.2 ; port ADC1_IN13
ADC1_IN14: P5.9 ; port ADC1_IN14
ADC1_IN15: P5.7 ; port ADC1_IN15
I2C2_SCL: P2.1 ; port I2C2_SCL
I2C2_SDA: P2.2 ; port I2C2_SDA
USART1_RX: P3.1 ; port USART1_RX
USART1_TX: P3.2 ; port USART1_TX
USART2_RX: P4.1 ; port USART2_RX
USART2_TX: P4.2 ; port USART2_TX

### Library data of the parts
P2-P4 = Header 4: Header, 4-Pin
P5 = Header 5X2: Header, 5-Pin, Dual row; LatestRevisionDate: 17-Jul-2002; LatestRevisionNote: Re-released for DXP Platform.; Publisher: Altium Limited

## Nets that join several sheets
3V3: Power (5 pins), MCU (12 pins), MotorDriver (17 pins), Debug (19 pins), Peripheral (P5.1)
5V: Power (7 pins), MotorDriver (17 pins), Peripheral (P2.3 P3.3 P4.3)
GND: Power (17 pins), MCU (19 pins), MotorDriver (52 pins), Debug (16 pins), Peripheral (P2.4 P3.4 P4.4 P5.10)
VM: Power (C1.1 L1.1 SW1.3), MotorDriver (14 pins)
ADC1_IN8: MCU (U3.26), Peripheral (P5.5)
ADC1_IN9: MCU (U3.27), Peripheral (P5.3)
ADC1_IN10: MCU (U3.8), Peripheral (P5.8)
ADC1_IN11: MCU (U3.9), Peripheral (P5.6)
ADC1_IN12: MCU (U3.10), Peripheral (P5.4)
ADC1_IN13: MCU (U3.11), Peripheral (P5.2)
ADC1_IN14: MCU (U3.24), Peripheral (P5.9)
ADC1_IN15: MCU (U3.25), Peripheral (P5.7)
BUZZER: MCU (U3.14), Debug (R55.1)
DEBUG_LED: MCU (U3.4), Debug (LED18.2)
ENCODER1_A: MCU (U3.62), MotorDriver (U4.18)
ENCODER1_B: MCU (U3.54), MotorDriver (U4.17)
ENCODER2_A: MCU (U3.51), MotorDriver (U4.14)
ENCODER2_B: MCU (U3.52), MotorDriver (U4.13)
ENCODER3_A: MCU (U3.34), MotorDriver (U6.14)
ENCODER3_B: MCU (U3.33), MotorDriver (U6.13)
ENCODER4_A: MCU (U3.36), MotorDriver (U6.18)
ENCODER4_B: MCU (U3.35), MotorDriver (U6.17)
I2C2_SCL: MCU (U3.29), Peripheral (P2.1)
I2C2_SDA: MCU (U3.30), Peripheral (P2.2)
INPUT_LOAD: MCU (U3.50), Debug (U12.1)
LED7_EN1: MCU (U3.45), Debug (R62.2)
LED7_EN2: MCU (U3.44), Debug (R63.2)
LED_EN: MCU (U3.41), Debug (R59.2)
LED_LATCH: MCU (U3.53), Debug (U13.12)
M1_DIR: MCU (U3.2), MotorDriver (U4.4)
M1_PWM: MCU (U3.40), MotorDriver (U4.5)
M2_DIR: MCU (U3.3), MotorDriver (U4.8)
M2_PWM: MCU (U3.39), MotorDriver (U4.9)
M3_DIR: MCU (U3.28), MotorDriver (U6.9)
M3_PWM: MCU (U3.37), MotorDriver (U6.8)
M4_DIR: MCU (U3.15), MotorDriver (U6.5)
M4_PWM: MCU (U3.38), MotorDriver (U6.4)
RC_SERVO_1: MCU (U3.61), MotorDriver (U9.1)
RC_SERVO_2: MCU (U3.59), MotorDriver (U9.3)
RC_SERVO_3: MCU (U3.58), MotorDriver (U9.5)
SM_DIR: MCU (U3.57), MotorDriver (U11.20)
SM_FAULT: MCU (U3.55), MotorDriver (R42.1 U11.18)
SM_STEP: MCU (U3.56), MotorDriver (U11.22)
SPI1_MISO: MCU (U3.22), Debug (U12.9)
SPI1_MOSI: MCU (U3.23), Debug (U13.14)
SPI1_SCK: MCU (U3.21), Debug (U12.2 U13.11)
SWCLK: MCU (U3.49), Debug (P1.1)
SWDIO: MCU (U3.46), Debug (P1.2)
USART1_RX: MCU (U3.43), Peripheral (P3.1)
USART1_TX: MCU (U3.42), Peripheral (P3.2)
USART2_RX: MCU (U3.17), Peripheral (P4.1)
USART2_TX: MCU (U3.16), Peripheral (P4.2)